# EAGLE design basic-inline-turbidimeter_sensor_board_2led (EAGLE 7.3.0)
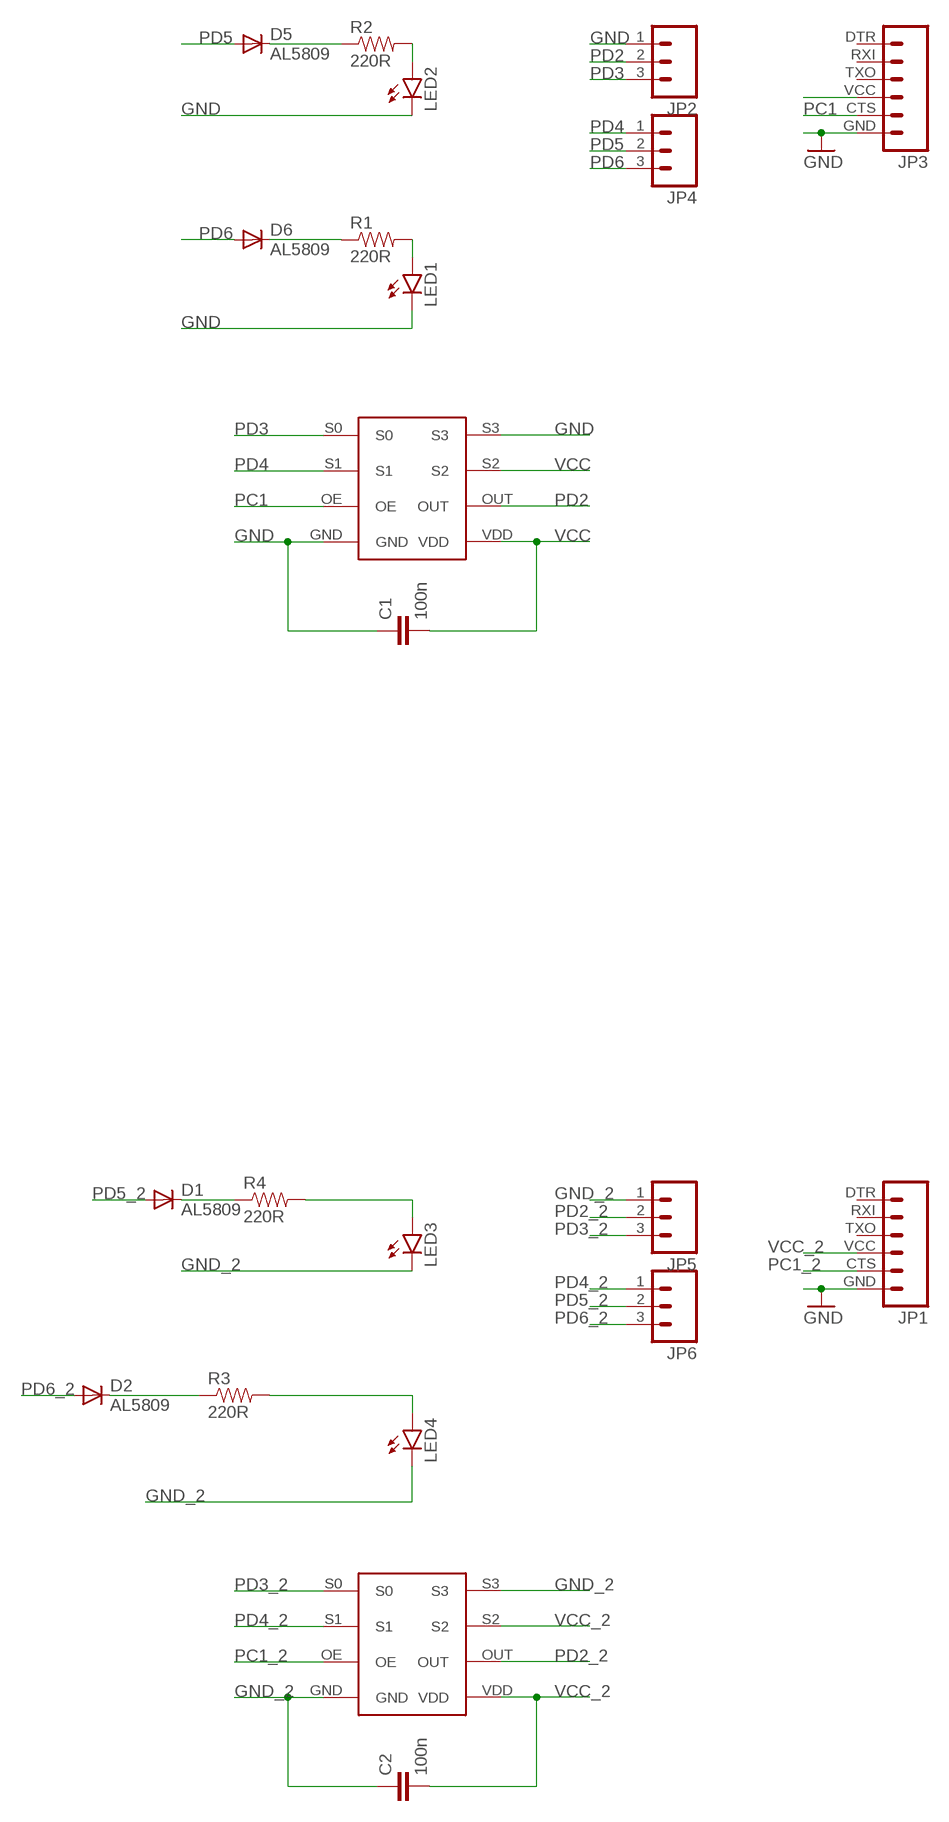
[diagram p0: schematic, sheet 1]

## Parts
C1  100n  CAP0805  [0805]
C2  100n  CAP0805  [0805]
D1  AL5809  DIODE-SOD123  [SOD123]
D2  AL5809  DIODE-SOD123  [SOD123]
D5  AL5809  DIODE-SOD123  [SOD123]
D6  AL5809  DIODE-SOD123  [SOD123]
JP1  M06SIP  [1X06]
JP2  M03PTH  [1X03]
JP3  M06SIP  [1X06]
JP4  M03PTH  [1X03]
JP5  M03PTH  [1X03]
JP6  M03PTH  [1X03]
LED1  LED5MM  [LED5MM]
LED2  LED5MM  [LED5MM]
LED3  LED5MM  [LED5MM]
LED4  LED5MM  [LED5MM]
R1  220R  RESISTOR0603  [0603-RES]
R2  220R  RESISTOR0603  [0603-RES]
R3  220R  RESISTOR0603  [0603-RES]
R4  220R  RESISTOR0603  [0603-RES]
U$1  TSL230RDSMD  [TSL230RD]
U$3  TSL230RDSMD  [TSL230RD]

## Nets
GND: C1.1 JP2.1 JP3.GND LED1.K(C) LED2.K(C) U$1.GND U$1.S3
GND_2: C2.1 JP1.GND JP5.1 LED3.K(C) LED4.K(C) U$3.GND U$3.S3 ; supply symbol labelled GND
LED1: D1.C R4.1
LED2: D2.C R3.1
N$1: LED1.A R1.2
N$2: LED4.A R3.2
N$3: LED2.A R2.2
N$4: LED3.A R4.2
N$5: D6.C R1.1
N$7: D5.C R2.1
PC1: JP3.CTS U$1.OE
PC1_2: JP1.CTS U$3.OE
PD2: JP2.2 U$1.OUT
PD2_2: JP5.2 U$3.OUT
PD3: JP2.3 U$1.S0
PD3_2: JP5.3 U$3.S0
PD4: JP4.1 U$1.S1
PD4_2: JP6.1 U$3.S1
PD5: D5.A JP4.2
PD5_2: D1.A JP6.2
PD6: D6.A JP4.3
PD6_2: D2.A JP6.3
VCC: C1.2 JP3.VCC U$1.S2 U$1.VDD
VCC_2: C2.2 JP1.VCC U$3.S2 U$3.VDD
Unconnected: JP1.DTR JP1.RXI JP1.TXO JP3.DTR JP3.RXI JP3.TXO

## Library data of the parts
C1 C2 = SparkFun-Capacitors:CAP: Capacitor Standard 0603 ceramic capacitor, and 0.1" leaded capacitor.
D1 D2 D5 D6 = diode:DIODE-: DIODE
JP1 JP3 = SparkFun-Connectors:M06: Header 6 Standard 6-pin 0.1" header. Use with straight break away headers (SKU : PRT-00116), right angle break away headers (PRT-00553), swiss pins (PRT-00743), machine pins (PRT-00117), and female headers (PRT-00115). Molex polarized connector foot print use with SKU : PRT-08094 with associated crimp pins and housings. NOTES ON THE VARIANTS LOCK and LOCK_LONGPADS... This footprint was designed to help hold the alignment of a through-hole component (i.e. 6-pin header) while soldering it into place. You may notice that each hole has been shifted either up or down by 0.005 of an inch from it's more standard position (which is a perfectly straight line). This slight alteration caused the pins (the squares in the middle) to touch the edges of the holes. Because they are alternating, it causes a "brace" to hold the component in place. 0.005 has proven to be the perfect amount of "off-center" position when using our standard breakaway headers. Although looks a little odd when you look at the bare footprint, once you have a header in there, the alteration is very hard to notice. Also,if you push a header all the way into place, it is covered up entirely on the bottom side. This idea of altering the position of holes to aid alignment will be further integrated into the Sparkfun Library for other footprints. It can help hold any component with 3 or more connection pins.
JP2 JP4-JP6 = SparkFun-Connectors:M03: Header 3 Standard 3-pin 0.1" header. Use with straight break away headers (SKU : PRT-00116), right angle break away headers (PRT-00553), swiss pins (PRT-00743), machine pins (PRT-00117), and female headers (PRT-00115). Molex polarized connector foot print use with SKU : PRT-08232 with associated crimp pins and housings.
LED1-LED4 = SparkFun-LED:LED: LEDs Standard schematic elements and footprints for 5mm, 3mm, 1206, and 0603 sized LEDs. 5mm - Spark Fun Electronics SKU : COM-00529 (and others)
R1-R4 = SparkFun-Resistors:RESISTOR: Resistor Basic schematic elements and footprints for 0603, 1206, and PTH resistors.
U$1 U$3 = open_source_turbidimeter:TSL230RD

## Board
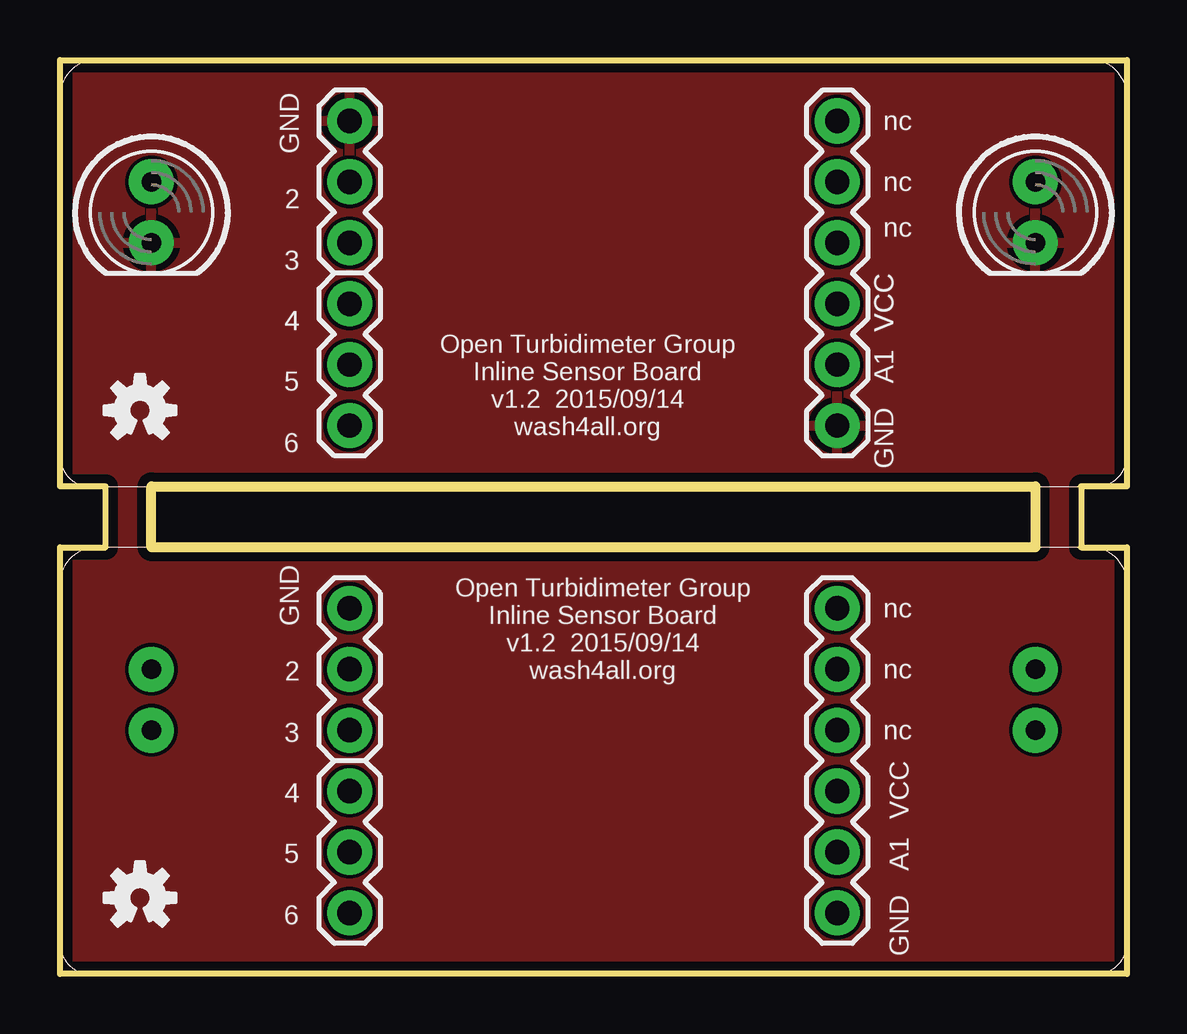
[diagram p1: board, top side]
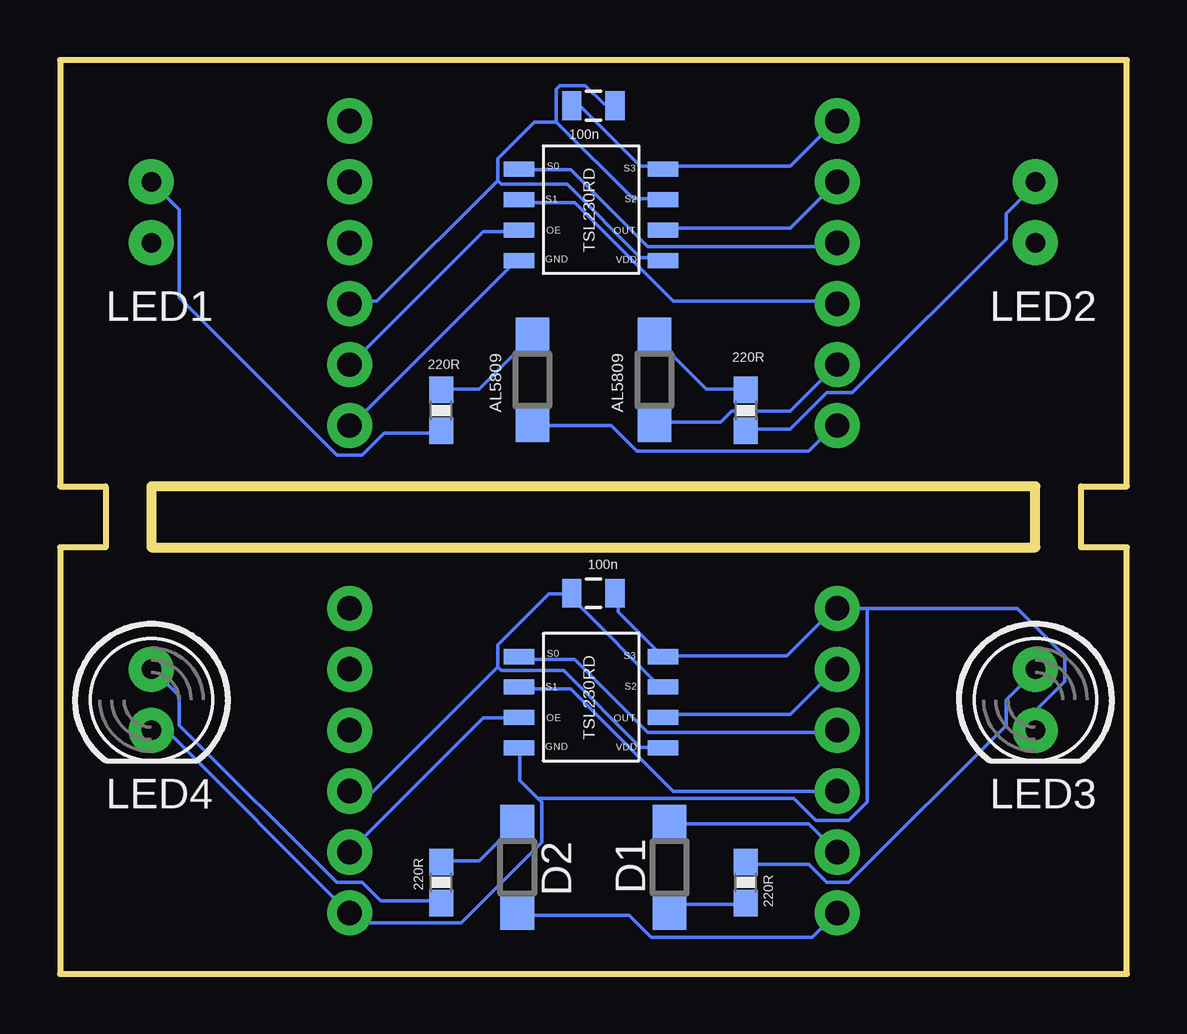
[diagram p2: board, bottom side, seen from below]

Size 44.45 x 38.1 mm. Coordinates in mm from the lower left corner, seen from the top.
Outline: 0,0 0,17.78 1.91,17.78 1.91,20.32 0,20.32 0,38.1 44.45,38.1 44.45,20.32 42.55,20.32 42.55,17.78 44.45,17.78 44.45,0 0,0
Outline: 3.81,20.32 40.64,20.32 40.64,17.78 3.81,17.78 3.81,20.32
Copper layers (1*16): Top 0.0356mm / dielectric 1.5011mm / Bottom 0.0356mm
Design rules "default *": minimum track width 6mil, minimum drill 13mil, track to track 6mil, track to pad 6mil, pad to pad 6mil, via to via 6mil, smd to smd 6mil, copper to edge 15mil, drill to drill 6mil, minimum pad ring 7mil, minimum via ring 7mil, stop-mask expansion 4mil, vias tented up to drill 15mil, thermal gap 10mil

### Footprints (pad centres in the part's own frame; a part is rotated, then mirrored left to right if it is on the bottom)
0805 = smd 0.8 x 1.2: 1 -0.9,0; 2 0.9,0
SOD123 = smd 1.4 x 1.4: A 1.9,0; C -1.9,0
1X06 = drill 1.016 pad 1.88: CTS 10.16,0; DTR 0,0; GND 12.7,0; RXI 2.54,0; TXO 5.08,0; VCC 7.62,0
1X03 = drill 1.016 pad 1.88: 1 0,0; 2 2.54,0; 3 5.08,0
LED5MM = drill 0.813 pad 1.88: A -1.27,0; K 1.27,0
0603-RES = smd 1.1 x 1: 1 -0.85,0; 2 0.85,0
TSL230RD = smd 0.635 x 1.27: GND 0.53,5; OE 1.8,5; OUT 1.8,-1; S0 4.34,5; S1 3.07,5; S2 3.07,-1; S3 4.34,-1; VDD 0.53,-1

### Placement (x,y rotation side)
C1  22.23,36.2 0 bottom
C2  22.23,15.88 180 bottom
D1  19.05,4.45 90 bottom
D2  25.4,4.45 270 bottom
D5  19.68,24.77 270 bottom
D6  24.77,24.77 270 bottom
JP1  32.38,15.24 270 top
JP2  12.06,35.56 270 top
JP3  32.38,35.56 270 top
JP4  12.06,27.94 270 top
JP5  12.06,15.24 270 top
JP6  12.06,7.62 270 top
LED1  40.64,31.75 270 top
LED2  3.81,31.75 270 top
LED3  3.81,11.43 270 bottom
LED4  40.64,11.43 270 bottom
R1  28.57,23.5 270 bottom
R2  15.88,23.5 270 bottom
R3  28.57,3.81 270 bottom
R4  15.88,3.81 90 bottom
U$1  20.32,29.21 90 bottom
U$2  [OSHW-LOGO-S]  3.33,23.5 0 top
U$3  20.32,8.89 90 bottom
U$5  [OSHW-LOGO-S]  3.33,3.17 0 top

### Tracks (layer width: path | path; a pad name or v marks a point on that pad's centre or on a via)
GND
  Bottom 0.152: C1.1 23.01,36.12 22.71,36.12 20.27,33.68 19.36,33.68 U$1.S3 19.2,33.68 14.02,33.68 12.19,35.51 JP2.1 | U$1.GND 25.45,29.72 32.31,22.86 JP3.GND
  pour Top: -4.45,42.55 47.62,42.55 47.62,-1.27 -4.45,-1.27
GND_2
  Bottom 0.152: C2.1 21.18,15.85 21.18,15.09 19.36,13.26 U$3.S3 19.2,13.26 14.17,13.26 12.19,15.24 JP5.1 10.82,15.24 | LED3.K 3.81,10.97 2.59,12.19 2.59,13.26 4.57,15.24 10.82,15.24 | 24.54,7.32 24.38,7.16 24.38,5.49 27.74,2.13 32,2.13 32.31,2.44 JP1.GND 32.46,2.59 39.93,10.06 40.54,10.06 LED4.K | 24.54,7.32 25.3,8.08 25.3,9.3 U$3.GND | 10.82,15.24 10.82,7.16 11.58,6.4 12.95,6.4 13.87,7.32 24.54,7.32
LED1
  Bottom 0.152: R4.1 16,2.9 18.75,2.9 19.05,2.59 D1.C
LED2
  Bottom 0.152: R3.1 28.5,4.72 26.98,4.72 25.45,6.25 D2.C
N$1
  Bottom 0.152: LED1.A 39.47,31.85 39.47,28.19 32.92,21.64 31.85,21.64 30.94,22.55 28.65,22.55 R1.2
N$2
  Bottom 0.152: R3.2 28.65,3.05 31.09,3.05 31.85,3.81 32.92,3.81 39.47,10.36 39.47,11.58 40.54,12.65 LED4.A
N$3
  Bottom 0.152: R2.2 15.85,22.71 14.02,22.71 12.5,24.23 11.43,24.23 5.03,30.63 5.03,31.7 3.81,32.92 LED2.A
N$4
  Bottom 0.152: R4.2 15.85,4.57 13.26,4.57 12.5,3.81 11.58,3.81 5.03,10.36 5.03,11.43 3.81,12.65 LED3.A
N$5
  Bottom 0.152: R1.1 28.5,24.38 26.98,24.38 24.84,26.52 D6.C
N$7
  Bottom 0.152: R2.1 16,24.38 17.53,24.38 19.66,26.52 D5.C
PC1
  Bottom 0.152: U$1.OE 25.45,30.94 26.82,30.94 32.31,25.45 JP3.CTS
PC1_2
  Bottom 0.152: U$3.OE 25.45,10.67 26.82,10.67 32.31,5.18 JP1.CTS
PD2
  Bottom 0.152: U$1.OUT 19.2,31.09 14.02,31.09 12.19,32.92 JP2.2
PD2_2
  Bottom 0.152: U$3.OUT 19.2,10.82 14.02,10.82 12.19,12.65 JP5.2
PD3
  Bottom 0.152: U$1.S0 25.3,33.53 23.16,33.53 19.96,30.33 12.34,30.33 12.19,30.48 JP2.3
PD3_2
  Bottom 0.152: U$3.S0 25.3,13.11 23.01,13.11 19.96,10.06 12.19,10.06 JP5.3
PD4
  Bottom 0.152: U$1.S1 25.3,32.16 23.01,32.16 18.9,28.04 12.19,28.04 JP4.1
PD4_2
  Bottom 0.152: JP6.1 18.9,7.62 23.16,11.89 25.3,11.89 U$3.S1
PD5
  Bottom 0.152: D5.A 19.66,23.01 16.92,23.01 16.46,23.47 14.02,23.47 12.19,25.3 JP4.2
PD5_2
  Bottom 0.152: D1.A 19.05,6.25 13.26,6.25 12.19,5.18 JP6.2
PD6
  Bottom 0.152: D6.A 24.69,22.86 21.49,22.86 20.42,21.79 13.26,21.79 12.19,22.86 JP4.3
PD6_2
  Bottom 0.152: D2.A 25.3,2.44 20.73,2.44 19.81,1.52 13.11,1.52 12.19,2.44 JP6.3
VCC
  Bottom 0.152: 23.77,35.51 23.77,36.88 23.62,37.03 22.55,37.03 21.79,36.27 21.34,36.27 C1.2 | 23.77,35.51 20.57,32.31 19.36,32.31 U$1.S2 | 26.21,33.07 26.06,32.92 23.32,32.92 20.27,29.87 19.36,29.87 U$1.VDD | 26.21,33.07 26.21,33.98 24.69,35.51 23.77,35.51 | 26.21,33.07 31.24,28.04 32.31,28.04 JP3.VCC
VCC_2
  Bottom 0.152: U$3.S2 19.36,11.89 23.01,15.54 23.01,15.85 C2.2 23.16,15.85 24.08,15.85 26.21,13.72 26.21,12.8 | 26.21,12.8 26.06,12.65 23.47,12.65 20.27,9.45 19.36,9.45 U$3.VDD | JP1.VCC 31.39,7.62 26.21,12.8

### Text on the board
tPlace: nc | 2 | nc | nc | 3 | VCC | VCC | 4 | 4 | A1 | 5 | Open Turbidimeter Group / Inline Sensor Board / v1.2 2015/09/14 / wash4all.org | GND | 6 | nc | Open Turbidimeter Group / Inline Sensor Board / v1.2 2015/09/14 / wash4all.org | 2 | nc | 3 | nc | VCC | 4 | A1 | 5 | 6 | GND
tNames: GND | GND